# Altium schematic sheet Power.SchDoc
size 241 x 190 mm; SheetNumber: 4; SheetTotal: 4
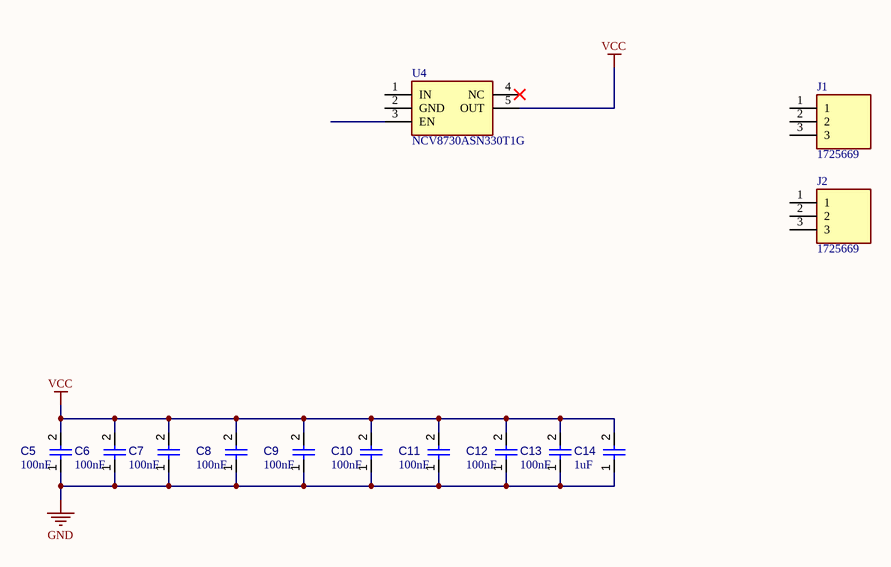
[diagram p0: Power.SchDoc]

## Parts
C5  value 100nF  [CAPC0603(1608)100_L]  (hidden comment: Capacitors,0603,smt,100nF)
C6  value 100nF  [CAPC0603(1608)100_L]  (hidden comment: Capacitors,0603,smt,100nF)
C7  value 100nF  [CAPC0603(1608)100_L]  (hidden comment: Capacitors,0603,smt,100nF)
C8  value 100nF  [CAPC0603(1608)100_L]  (hidden comment: Capacitors,0603,smt,100nF)
C9  value 100nF  [CAPC0603(1608)100_L]  (hidden comment: Capacitors,0603,smt,100nF)
C10  value 100nF  [CAPC0603(1608)100_L]  (hidden comment: Capacitors,0603,smt,100nF)
C11  value 100nF  [CAPC0603(1608)100_L]  (hidden comment: Capacitors,0603,smt,100nF)
C12  value 100nF  [CAPC0603(1608)100_L]  (hidden comment: Capacitors,0603,smt,100nF)
C13  value 100nF  [CAPC0603(1608)100_L]  (hidden comment: Capacitors,0603,smt,100nF)
C14  value 1uF  [CAPC0603(1608)100_L]  (hidden comment: Capacitors,0603,smt,1uF)
J1  1725669  [1725669]
J2  1725669  [1725669]
U4  NCV8730ASN330T1G  [SOT95P275X110-5N]

## Nets
GND: C5.1 C6.1 C7.1 C8.1 C9.1 C10.1 C11.1 C12.1 C13.1 C14.1
VCC: C5.2 C6.2 C7.2 C8.2 C9.2 C10.2 C11.2 C12.2 C13.2 C14.2 U4.5(OUT)

Not connected (* = marked no-connect by the designer): J1 1 2 3; J2 1 2 3; U4 1(IN) 2(GND) 3(EN) 4(NC)*

## Notes on the sheet
- Title
- Author
- Date
- Texas A&M Sounding Rocketry Team
- Revision

## Library data of the parts
C5-C14 = Capacitors: Capacitor; Mounting Technology: smt; Case/Package: 0603; Component Type: Capacitors
J1 J2 = 1725669: Connector; Manufacturer_Name: Phoenix Contact; Datasheet Link: https://www.phoenixcontact.com/online/portal/us?uri=pxc-oc-itemdetail:pid=1725669&library=usen&tab=1; Height: 8.65mm; Manufacturer_Part_Number: 1725669; Mouser Part Number: 651-1725669; Mouser Price/Stock: https://www.mouser.co.uk/ProductDetail/Phoenix-Contact/1725669?qs=A%2FKWGUWTCZjmkTL0Oe91ew%3D%3D; Arrow Part Number: 1725669; Arrow Price/Stock: https://www.arrow.com/en/products/1725669/phoenix-contact?utm_currency=USD&region=nac
U4 = NCV8730ASN330T1G: Integrated Circuit; Manufacturer_Name: onsemi; Datasheet Link: https://www.onsemi.com/pub/Collateral/NCV8730-D.PDF; Height: 1.1mm; Manufacturer_Part_Number: NCV8730ASN330T1G; Mouser Part Number: 863-NCV8730ASN330T1G; Mouser Price/Stock: https://www.mouser.co.uk/ProductDetail/onsemi/NCV8730ASN330T1G?qs=GedFDFLaBXG9IOwczGXdzg%3D%3D; Arrow Part Number: NCV8730ASN330T1G; Arrow Price/Stock: https://www.arrow.com/en/products/ncv8730asn330t1g/on-semiconductor?region=nac